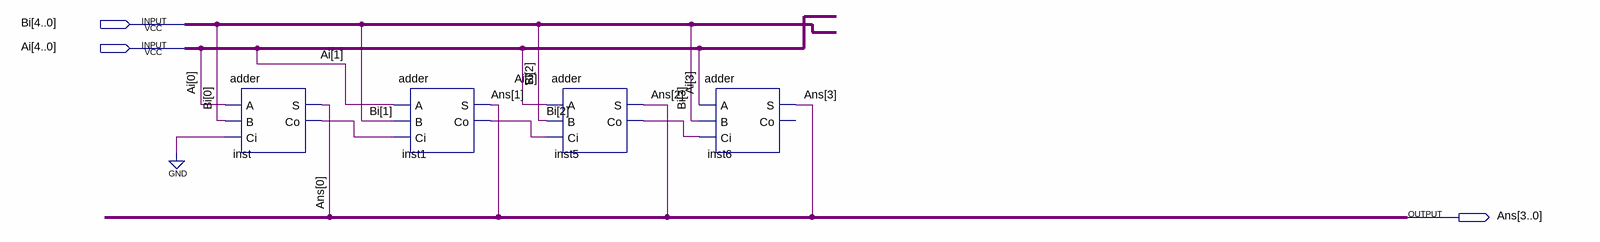
[diagram p0: schematic sheet]
// Quartus schematic module_adder.bdf as structural Verilog: 4 symbols, 3 pins
module module_adder (
  input  [4:0] Bi,
  input  [4:0] Ai,
  output [3:0] Ans
);

  wire inst1_co, inst5_co, inst_co;

  adder inst (.A(Ai[0]), .B(Bi[0]), .Ci(1'b0), .S(Ans[0]), .Co(inst_co));
  adder inst1 (.A(Ai[1]), .B(Bi[1]), .Ci(inst_co), .S(Ans[1]), .Co(inst1_co));
  adder inst5 (.A(Ai[2]), .B(Bi[2]), .Ci(inst1_co), .S(Ans[2]), .Co(inst5_co));
  adder inst6 (.A(Ai[3]), .B(Bi[3]), .Ci(inst5_co), .S(Ans[3]));  // open: Co
endmodule
